# EasyEDA Pro project 毕设.eprj, schematic Schematic1
Board Name: Board1; Create Date: 2025-01-23; Page Name: P1; Project Name: 毕设; Schematic Name: Schematic1; Update Date: 2025-03-16; Company: 嘉立创EDA; Page Size: A4; Version: V1.0
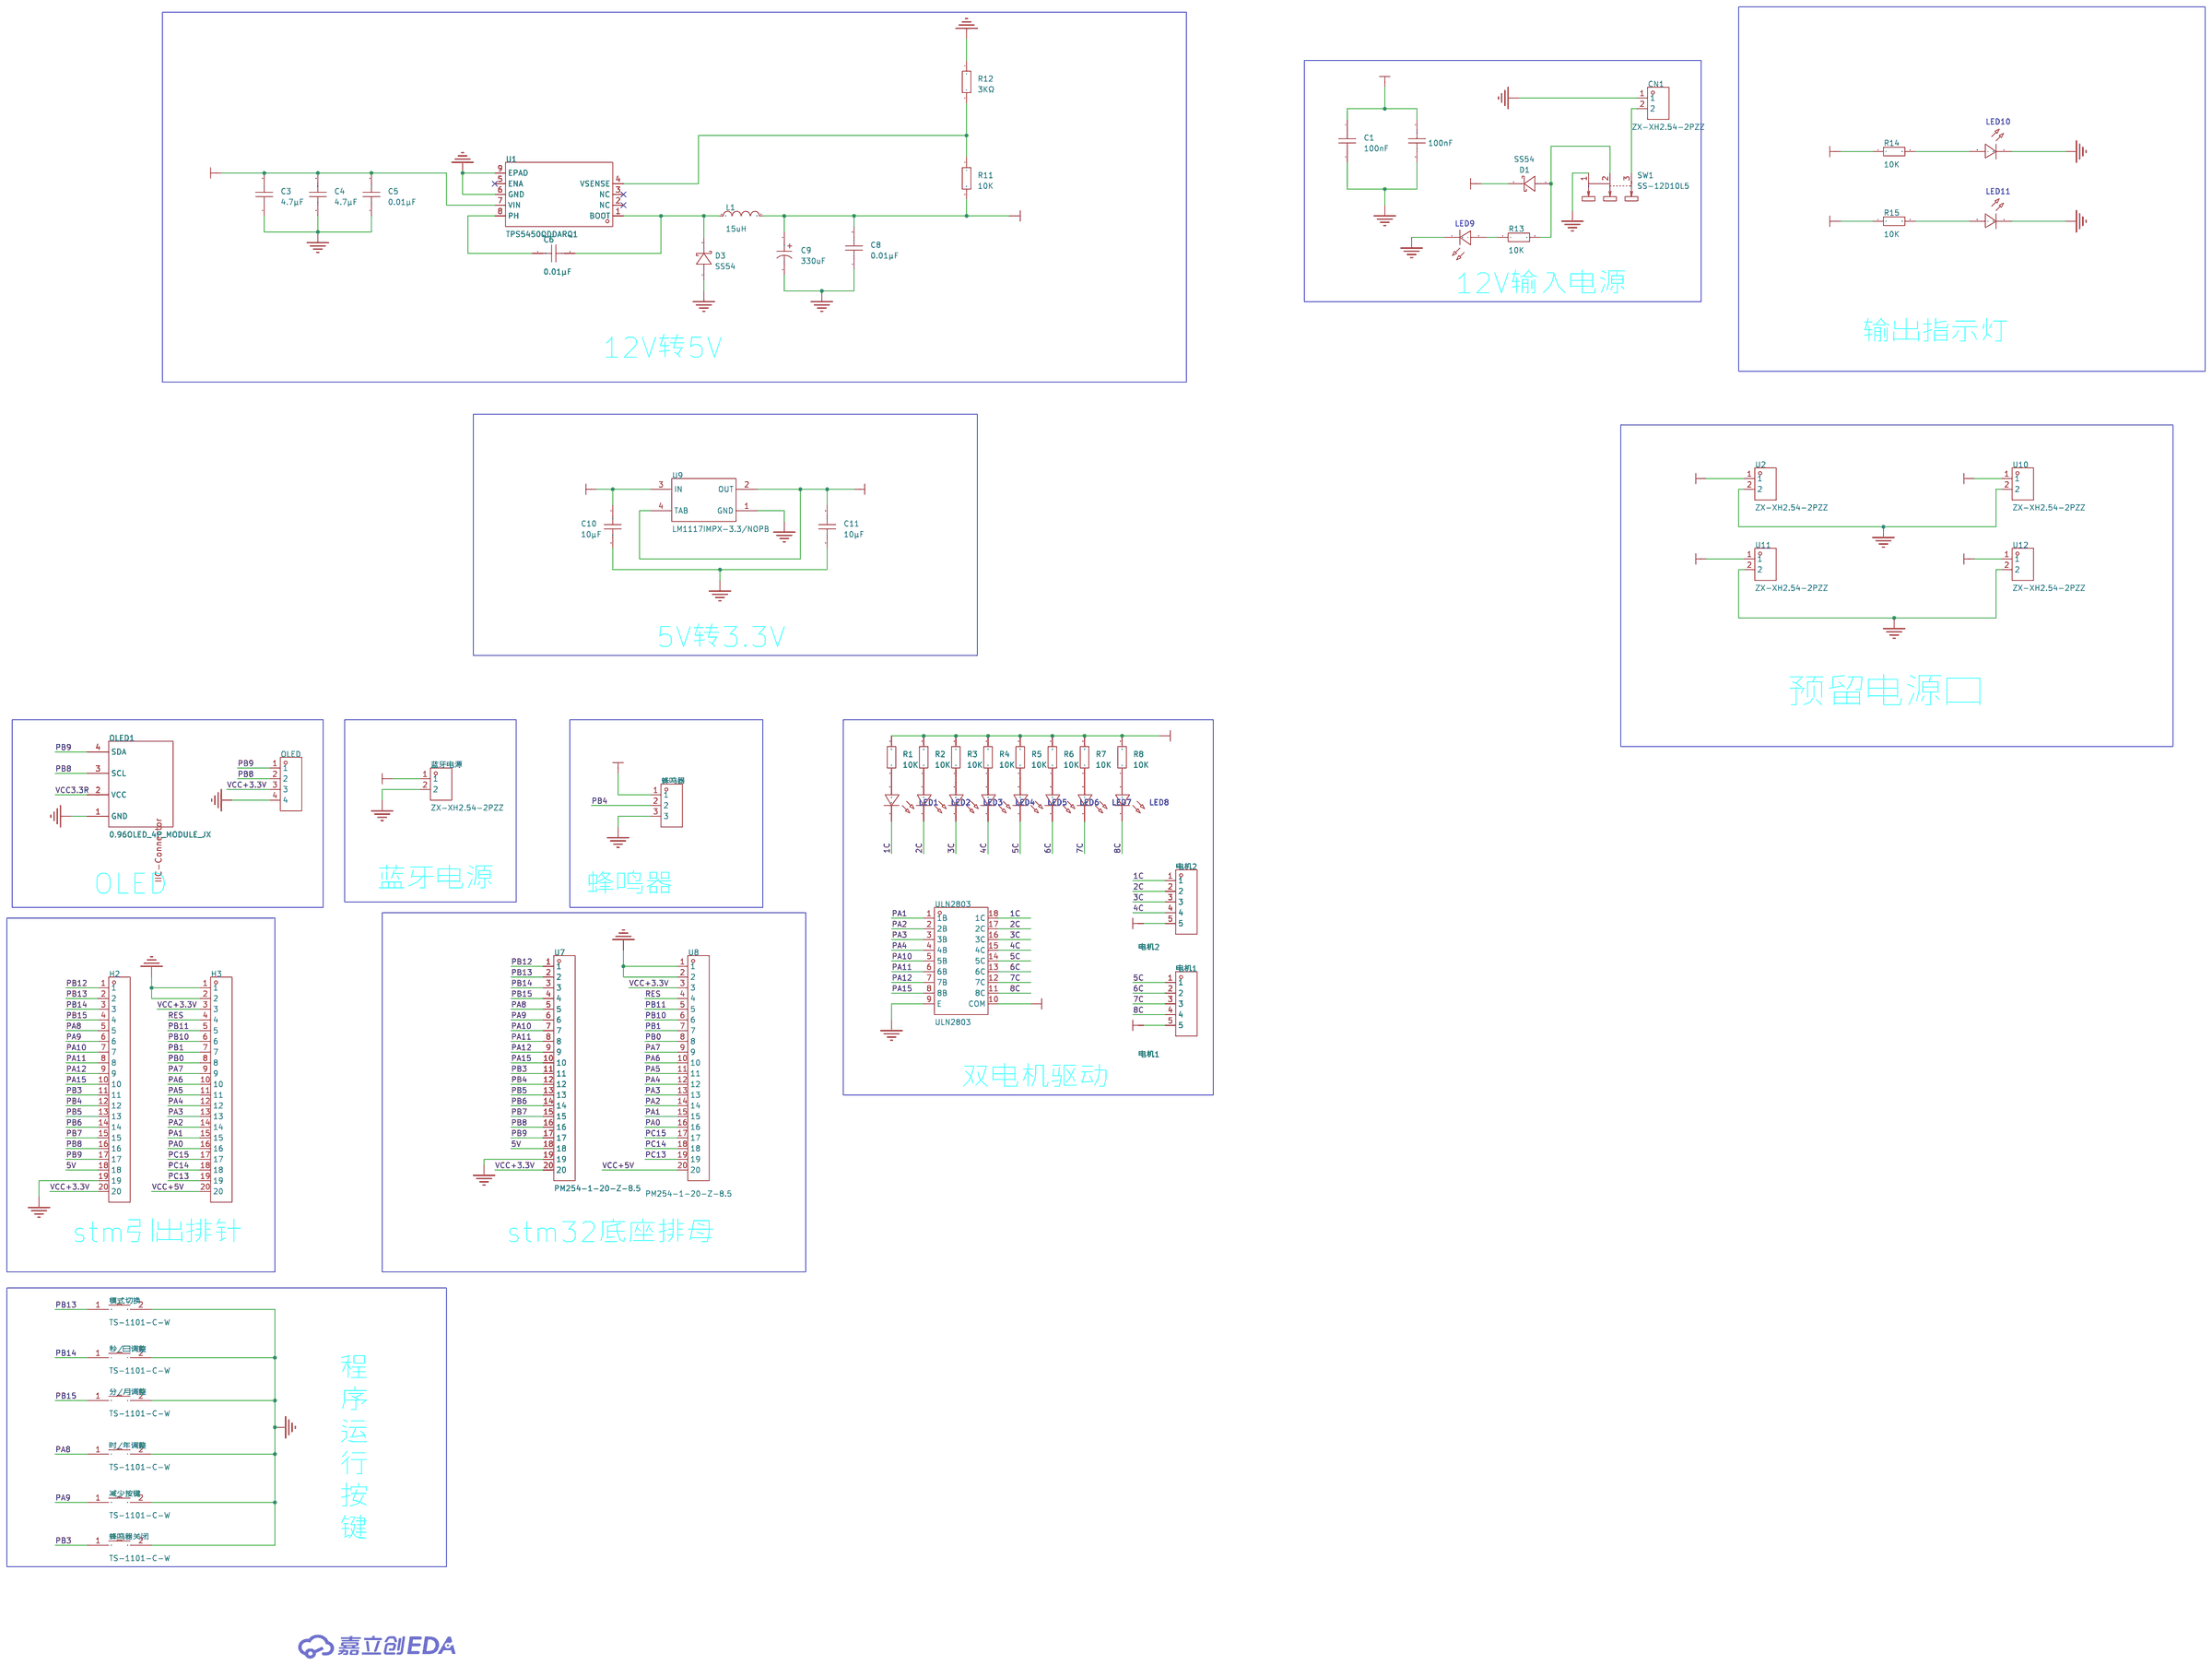
[diagram p0: schematic sheet]

## Parts
C1  100nF  [C0603]
C2  100nF  [C0603]
C3  4.7μF  [C0603]
C4  4.7μF  [C0603]
C5  0.01μF  [C0603]
C6  0.01μF  [C0603]
C8  0.01μF  [C0603]
C9  330uF  [CAP-SMD_BD6.3-L6.6-W6.6-LS7.3-FD]
C10  10μF  [C0603]
C11  10μF  [C0603]
CN1  ZX-XH2.54-2PZZ  [CONN-TH_2P-P2.50_HX25003-2A]
D1  SS54  [SMA_L4.3-W2.6-LS5.0-FD]
D3  SS54  [SMA_L4.3-W2.6-LS5.0-FD]
H2  -  [HDR-TH_20P-P2.54-V-M-1]
H3  -  [HDR-TH_20P-P2.54-V-M-1]
L1  15uH  [IND-SMD_L7.0-W6.6_FXL0630]
LED1  -  [LED_0603]
LED2  -  [LED_0603]
LED3  -  [LED_0603]
LED4  -  [LED_0603]
LED5  -  [LED_0603]
LED6  -  [LED_0603]
LED7  -  [LED_0603]
LED8  -  [LED_0603]
LED9  -  [LED_0603]
LED10  -  [LED_0603]
LED11  -  [LED_0603]
OLED  -  [HDR-TH_4P-P2.54-V-F]
OLED1  0.96OLED_4P_MODULE_JX  [0.96OLED_4P]
R1  10K  [R0603]
R2  10K  [R0603]
R3  10K  [R0603]
R4  10K  [R0603]
R5  10K  [R0603]
R6  10K  [R0603]
R7  10K  [R0603]
R8  10K  [R0603]
R11  10K  [R0603]
R12  3KΩ  [R0603]
R13  10K  [R0603]
R14  10K  [R0603]
R15  10K  [R0603]
SW1  SS-12D10L5  [SW-TH_SS-12D10L5]
U1  TPS5450QDDARQ1  [SOIC-8_L4.9-W3.9-P1.27-LS6.0-BL-EP]
U2  ZX-XH2.54-2PZZ  [CONN-TH_2P-P2.50_HX25003-2A]
U7  PM254-1-20-Z-8.5  [HDR-TH_20P-P2.54-V-F-2]
U8  PM254-1-20-Z-8.5  [HDR-TH_20P-P2.54-V-F-2]
U9  LM1117IMPX-3.3/NOPB  [SOT-223_L6.5-W3.5-P2.30-LS7.0-BR]
U10  ZX-XH2.54-2PZZ  [CONN-TH_2P-P2.50_HX25003-2A]
U11  ZX-XH2.54-2PZZ  [CONN-TH_2P-P2.50_HX25003-2A]
U12  ZX-XH2.54-2PZZ  [CONN-TH_2P-P2.50_HX25003-2A]
ULN2803  ULN2803  [SOP-18_L11.6-W7.5-P1.27-LS10.3-BL]
减少按键  TS-1101-C-W  [SW-SMD_L6.0-W3.3-LS8.0]
分/月调整  TS-1101-C-W  [SW-SMD_L6.0-W3.3-LS8.0]
时/年调整  TS-1101-C-W  [SW-SMD_L6.0-W3.3-LS8.0]
模式切换  TS-1101-C-W  [SW-SMD_L6.0-W3.3-LS8.0]
电机1  电机1  [CONN-TH_5P-P2.50_ZX-XH2.54-5PZZ]
电机2  电机2  [CONN-TH_5P-P2.50_ZX-XH2.54-5PZZ]
秒/日调整  TS-1101-C-W  [SW-SMD_L6.0-W3.3-LS8.0]
蓝牙电源  ZX-XH2.54-2PZZ  [CONN-TH_2P-P2.50_HX25003-2A]
蜂鸣器  -  [HDR-TH_3P-P2.54-V-F]
蜂鸣器关闭  TS-1101-C-W  [SW-SMD_L6.0-W3.3-LS8.0]

## Library data of the parts
C1-C6 C8 C10 C11 = CAP_0603: Supplier Footprint: 0603
C9 = GVM1E331M0607: LCSC Part Name: 330uF ±20% 25V; Supplier Part: C2980171; Manufacturer: HONOR(荣誉); Supplier Footprint: SMD,D6.3xL7.7mm; JLCPCB Part Class: 扩展库; Datasheet: https://atta.szlcsc.com/upload/public/pdf/source/20220509/EB2A569F0F3393644DE07704993C28AA.pdf; Supplier: LCSC; Tolerance: ±20%; Rated Voltage: 25V; φD: 6.3mm; L: 7.7mm; Lifetime @ Temp: 2000hrs@105℃; Operating Temperature: -55℃~+105℃
CN1 U2 U10-U12 蓝牙电源 = ZX-XH2.54-2PZZ: LCSC Part Name: 1x2P 间距:2.5mm 直插 系列:XH; Supplier Part: C7429632; Manufacturer: Megastar(兆星); Supplier Footprint: 插件,P=2.5mm; JLCPCB Part Class: 扩展库; Datasheet: https://atta.szlcsc.com/upload/public/pdf/source/20230619/19BA6947230AA44A04D3EDD65E618FD0.pdf; Supplier: LCSC; Pins Structure: 1x2P; Pitch: 2.5mm; Mounting Type: 直插; Reference Series: XH; Number of Pins: 2P; Number of Rows: 1; Number of PINs Per Row: 2; Rated Current: 3A; Contact Material: 黄铜; Contact Plating: 锡; Operating Temperature: -25℃~+85℃; Rated Voltage (Max): 250V; Plastic Material: PA66; Flame Retardant Rating: UL94V-0; Color: 白色; Z-Height of the Board: 7mm; X-Length of Bottom Edge on Board (Spacing Line): 7.5mm; Y-Width of Bottom Edge on Board: 5.9mm
D1 D3 = SS54_C7420369: LCSC Part Name: 电压:40V 电流:5A; Supplier Part: C7420369; Manufacturer: 宏迦橙; Supplier Footprint: SMA(DO-214AC); JLCPCB Part Class: 扩展库; Datasheet: https://atta.szlcsc.com/upload/public/pdf/source/20230828/254C3882F8647358AD9F60DD73611B5E.pdf; Supplier: LCSC; Diode Configuration: 独立式; Forward Voltage (Vf@If): 550mV@5.0A; Reverse Voltage (Vr): 40V; Rectified Current: 5A; Reverse Leakage Current (Ir): 50uA@40V
H2 H3 = HDR-M_2.54_1x20P: Supplier Part: C50981; Supplier Footprint: 插件
L1 = FXL0630-150-M: LCSC Part Name: 15uH ±20% 4.5A; Supplier Part: C177243; Manufacturer: cjiang(长江微电); Supplier Footprint: SMD,6.6x7mm; JLCPCB Part Class: 扩展库; Datasheet: https://atta.szlcsc.com/upload/public/pdf/source/20240426/3189EA8206330E2108542F9E34E540E7.pdf; Supplier: LCSC; Tolerance: ±20%; Rated Current: 3A; Saturation Current (Isat): 4.5A; DC Resistance (DCR): 115mΩ; Type: 一体成型电感
LED1-LED11 = LED_0603-G: Supplier Footprint: 0603
